# EasyEDA Pro project ProPrj_药盒0.11_2025-04-15.epro, board PCB1
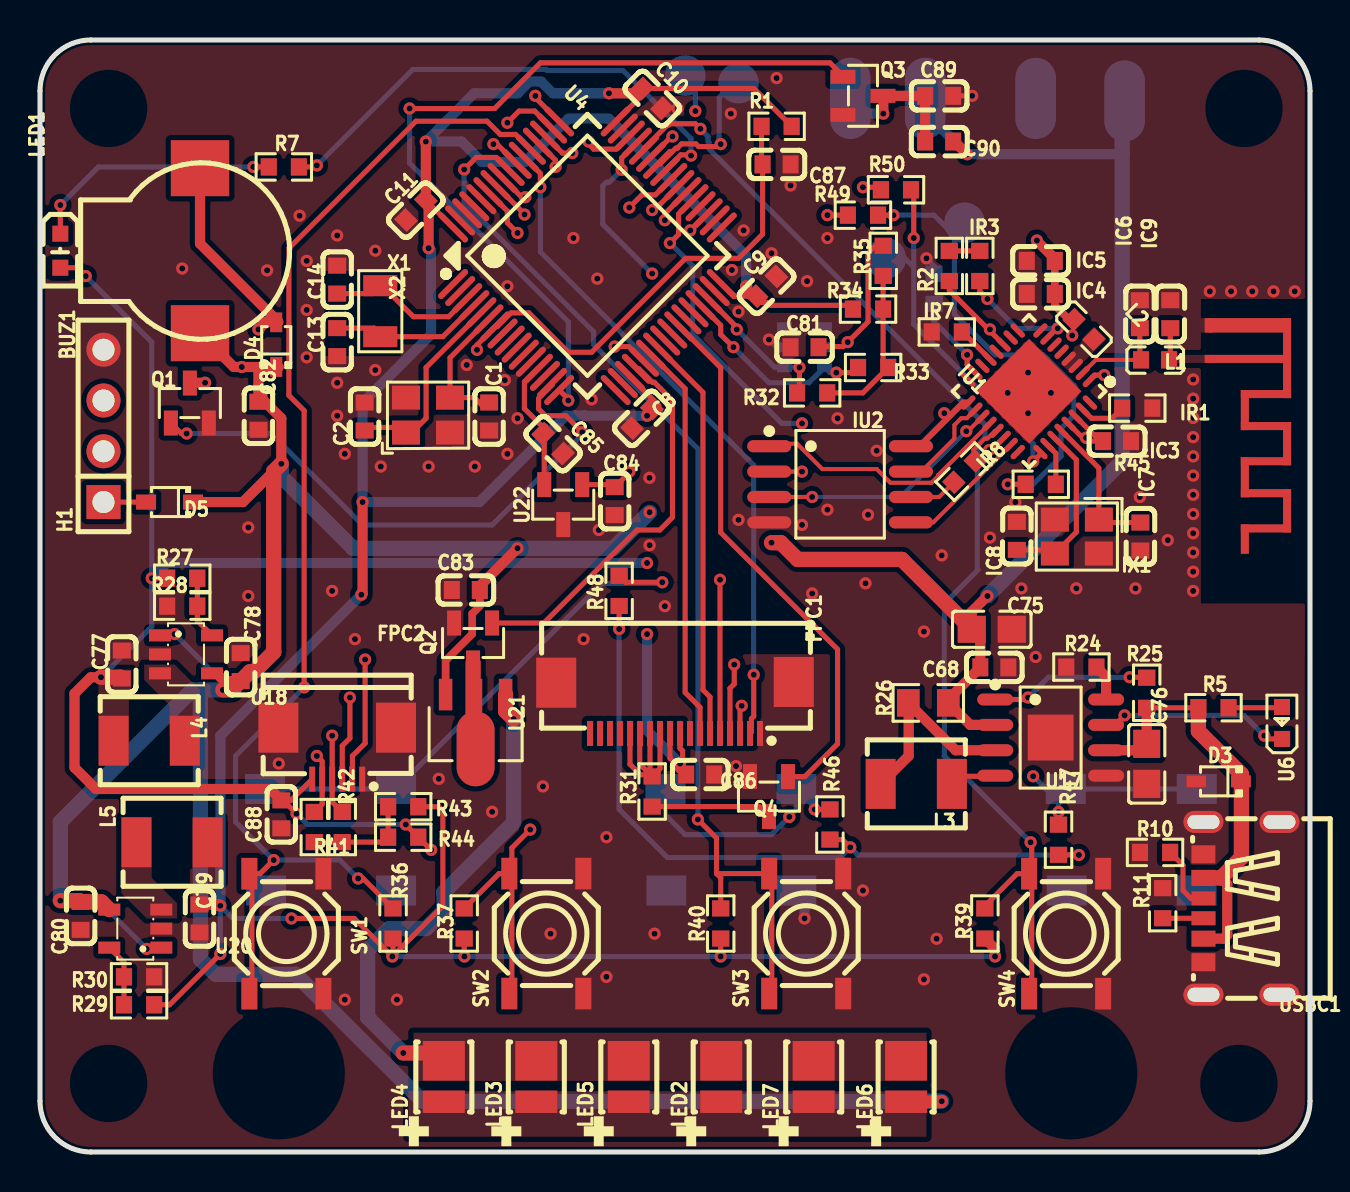
[diagram p9: board, top side]
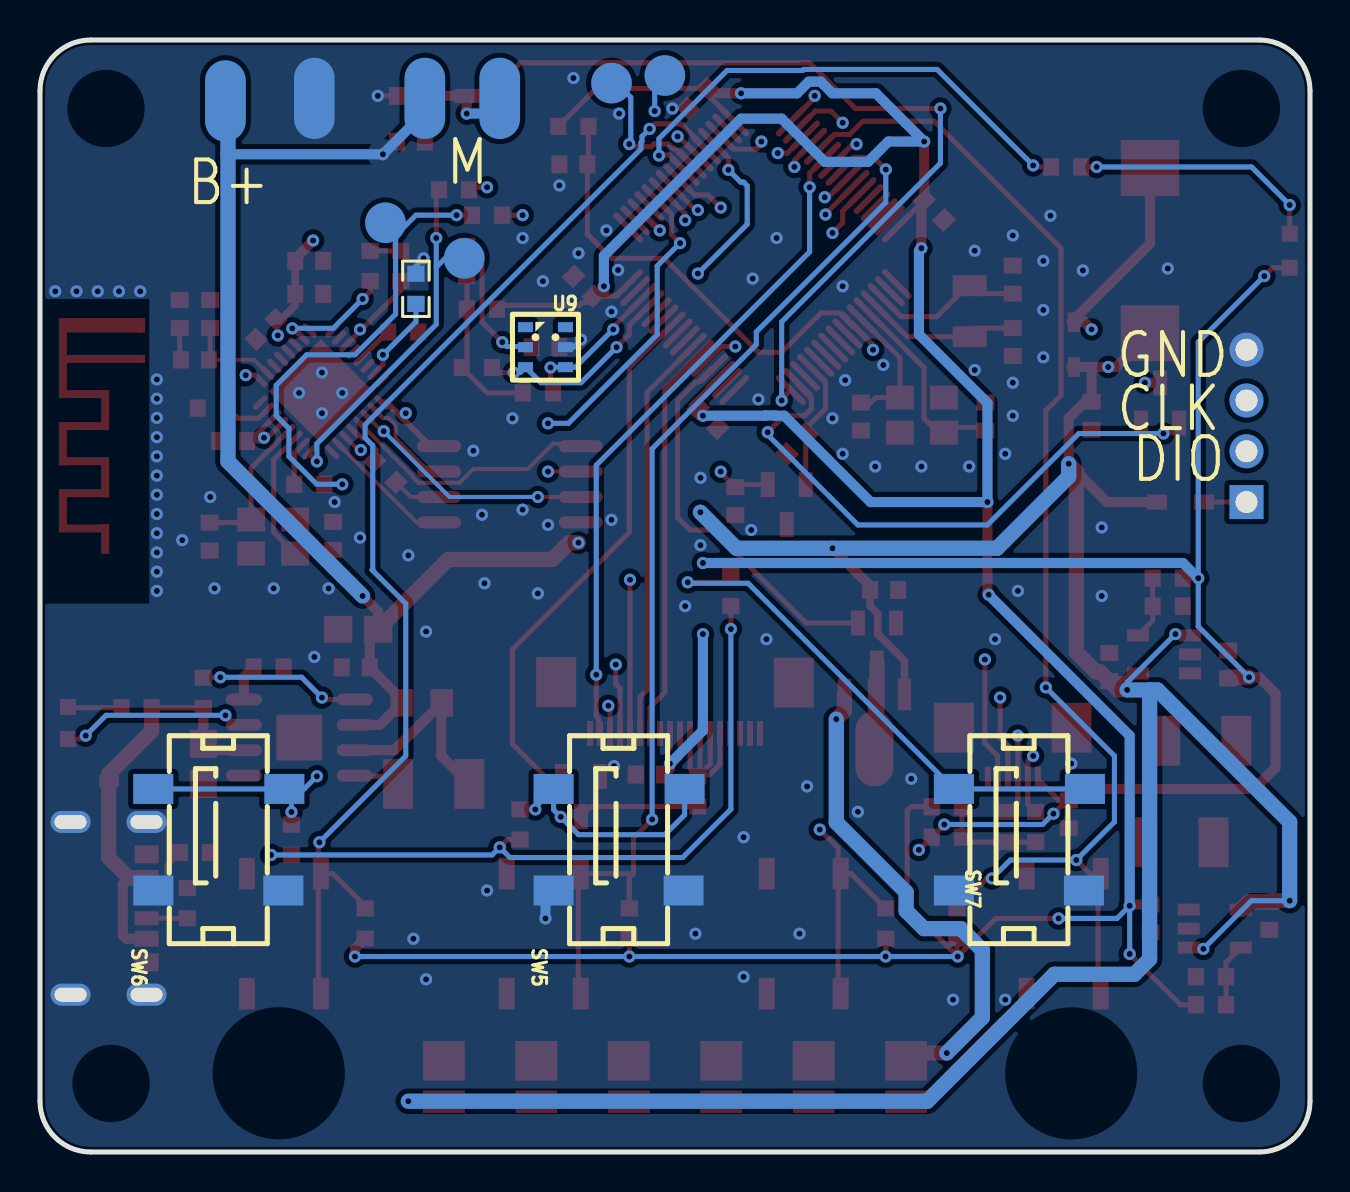
[diagram p10: board, bottom side, seen from below]

Outline 63.5 x 55.63 mm; copper layers: Top Layer, Inner1, Inner2, Bottom Layer. Coordinates in mm from the lower left corner of the outline.
Outline path: 0,53.09 0,2.54 arc(0.74,0.74) 2.54,0 60.96,0 arc(62.76,0.74) 63.5,2.54 63.5,53.09 arc(62.76,54.88) 60.96,55.63 2.54,55.63 arc(0.74,54.88) 0,53.09
Stack: Top Layer 0.035mm 外层铜厚1oz / Dielectric1 0.2104mm 7628 RC49% 8.6mil / Inner1 0.0152mm 内层铜厚 / Dielectric2 1.065mm 1.1mm H/HOZ Copper / Inner2 0.0152mm 内层铜厚 / Dielectric3 0.2104mm 7628 RC49% 8.6mil / Bottom Layer 0.035mm 外层铜厚1oz

## Design rules (mm)
template: 自定义配置
spacing copperThickness1oz (default): track to track 0.102, other pairs 0.152 to 0.3
spacing copperThickness2oz: track to track 0.203, other pairs 0.152 to 0.3
track width copperThickness1oz (default): min 0.127, default 0.254, max 2.54
track width copperThickness2oz: min 0.203, default 0.254, max 2.54
differential pair differentialPair (default): width min 0.127, default 0.254, max 2.54; gap min 0.152, default 0.152
via viaSize (default): diameter min 0.5, default 0.61, max 10; hole min 0.3, default 0.305, max 6.3

## Placement (name value [footprint] x y rotation side)
ANT2  -  [ANTENNA-2.4GHZ-MEANTRED]  62.36 40.51 90 top
BUZ1  9032蜂鸣器  [BUZ-SMD_KLJ-90XX-3627]  8 45.08 90 top
C1  22pF  [C0603]  22.46 36.79 90 top
C2  22pF  [C0603]  16.23 36.79 90 top
C8  100nF  [C0603]  30.1 36.7 45 top
C9  100nF  [C0603]  36.32 43.31 225 top
C10  100nF  [C0603]  30.61 52.7 135 top
C11  100nF  [C0603]  18.8 47.12 45 top
C13  22pF  [C0603]  14.86 40.51 90 top
C14  22pF  [C0603]  14.86 43.64 270 top
C68  100nF  [C0603]  47.72 24.24 0 top
C75  10uF  [C0805]  47.59 26.15 180 top
C76  22uF  [C0805]  55.34 19.42 270 top
C77  10uF  [C0603]  4.09 24.39 270 top
C78  10uF  [C0603]  10.03 24.26 270 top
C79  10uF  [C0603]  7.97 11.68 90 top
C80  10uF  [C0603]  2.03 11.81 90 top
C81  100nF  [C0603]  38.23 40.26 0 top
C82  1uF  [C0603]  10.92 36.83 90 top
C83  1uF  [C0603]  21.29 28.11 0 top
C84  1uF  [C0603]  28.74 32.56 90 top
C85  1uF  [C0603]  25.65 35.43 135 top
C86  1uF  [C0603]  33.01 18.88 180 top
C87  100nF  [C0603]  36.83 49.4 180 top
C88  1uF  [C0603]  12.06 16.89 90 top
C89  1uF  [C0603]  44.96 52.83 180 top
C90  100nF  [C0603]  44.96 50.55 180 top
D3  PESD5V0S1BA  [SOD-323_L1.7-W1.3-LS2.5-FD-1]  58.93 18.54 0 top
D4  5819WS  [SOD-323_L1.7-W1.3-LS2.5-FD-1]  11.81 40.39 270 top
D5  1N5819WS  [SOD-323_L1.8-W1.3-LS2.5-RD]  6.48 32.51 180 top
FPC1  FPC-05F-18PH20  [FPC-SMD_18P-P0.50_FPC-05F-18PH20]  31.75 22.22 180 top
FPC2  FPC-05F-6PH20  [FPC-SMD_6P-P0.50_XUNPU_FPC-05F-6PH20]  14.86 19.94 180 top
H1  Header-Male-2.54_1x4  [HDR-TH_4P-P2.54-V-M]  3.17 36.32 90 top
IC3  1uf  [C0603]  53.85 35.56 180 top
IC4  100nf  [C0603]  50.04 42.93 0 top
IC5  10uf  [C0603]  50.04 44.58 0 top
IC6  3.0pf  [C0603]  54.99 41.91 270 top
IC7  6.8pf  [C0603]  55.02 30.79 270 top
IC8  6.8pf  [C0603]  48.84 30.82 90 top
IC9  2.4pf  [C0603]  56.51 41.91 270 top
IR1  12k  [R0603]  54.86 37.21 180 top
IR3  10k  [R0603]  46.99 44.32 270 top
IR7  10k  [R0603]  45.34 41.02 0 top
IR8  200R  [R0603]  46.23 34.04 45 top
IU1  ESP8266EX  [QFN-32_L5.0-W5.0-P0.50-BL-EP3.7]  49.45 38.05 135 top
IU2  BH25Q64BSSIG  [SOP-8_L5.3-W5.3-P1.27-LS8.0-BL]  40 33.4 270 top
IX1  26MHz  [CRYSTAL-SMD_4P-L3.2-W2.5-BL]  51.84 30.79 180 top
L1  2.2nh  [L0603]  55.75 39.62 180 top
L2  4.3nh  [L0603]  52.2 41.15 315 top
L3  4.7uH  [IND-SMD_L4.9-W4.4_MAPM0420F]  43.81 18.41 0 top
L4  2.2uH  [IND-SMD_L4.9-W4.4_MAPM0420F]  5.46 20.57 180 top
L5  2.2uH  [IND-SMD_L4.9-W4.4_MAPM0420F]  6.6 15.49 0 top
LED1  19-217/GHC-YR1S2/3T  [LED0603-R-RD]  1.02 45.08 270 top
LED2  2835  [LED-SMD_L3.5-W2.8_2835]  34.06 3.54 90 top
LED3  2835  [LED-SMD_L3.5-W2.8_2835]  24.82 3.54 90 top
LED4  2835  [LED-SMD_L3.5-W2.8_2835]  20.19 3.54 90 top
LED5  2835  [LED-SMD_L3.5-W2.8_2835]  29.44 3.54 90 top
LED6  2835  [LED-SMD_L3.5-W2.8_2835]  43.31 3.54 90 top
LED7  2835  [LED-SMD_L3.5-W2.8_2835]  38.68 3.54 90 top
NOREF  -  [Pad_e279]  49.78 52.7 0 top
NOREF#2  -  [Pad_e3203]  42.29 44.7 90 top
NOREF#3  -  [Pad_e1042]  44.26 52.7 0 top
NOREF#4  -  [Pad_e612]  34.93 53.47 90 top
NOREF#5  -  [Pad_e1043]  40.51 52.7 0 top
NOREF#6  -  [Pad_e3204]  46.23 46.48 90 top
NOREF#7  -  [Pad_e68]  54.23 52.58 0 top
NOREF#8  -  [Pad_e611]  32.26 53.85 90 top
Q1  SI2300  [SOT-23-3_L2.9-W1.3-P1.90-LS2.4-BR]  7.49 37.46 270 top
Q2  SI2300  [SOT-23-3_L2.9-W1.3-P1.90-LS2.4-BR]  21.65 25.46 90 top
Q3  SI2300  [SOT-23-3_L2.9-W1.3-P1.90-LS2.4-BR]  41.15 52.83 180 top
Q4  SI2300  [SOT-23-3_L2.9-W1.3-P1.90-LS2.4-BR]  36.45 17.78 90 top
R1  10k  [R0603]  36.83 51.31 0 top
R2  R0  [R0603]  45.47 44.32 90 top
R5  1kΩ  [R0603]  58.67 22.22 0 top
R7  10KΩ  [R0603]  12.19 49.28 180 top
R10  5.1kΩ  [R0603]  55.75 14.99 0 top
R11  5.1kΩ  [R0603]  56.13 12.45 270 top
R24  20kΩ  [R0603]  52.07 24.26 0 top
R25  10kΩ  [R0603]  55.34 22.97 270 top
R26  0.5Ω  [R0805]  44.41 22.46 0 top
R27  442kΩ  [R0603]  7.11 28.7 180 top
R28  100kΩ  [R0603]  7.11 27.3 0 top
R29  200kΩ  [R0603]  4.95 7.37 0 top
R30  100kΩ  [R0603]  4.95 8.76 180 top
R31  10Ω  [R0603]  30.61 18.03 270 top
R32  4.7kΩ  [R0603]  38.61 37.97 0 top
R33  4.7kΩ  [R0603]  41.66 39.24 0 top
R34  0  [R0603]  41.4 42.16 180 top
R35  0  [R0603]  42.16 44.58 90 top
R36  10kΩ  [R0603]  17.65 11.43 270 top
R37  10kΩ  [R0603]  21.21 11.43 270 top
R39  10kΩ  [R0603]  47.24 11.43 270 top
R40  10kΩ  [R0603]  34.04 11.43 270 top
R41  2k  [R0603]  13.72 16.26 270 top
R42  2k  [R0603]  15.11 16.26 270 top
R43  0  [R0603]  18.16 17.27 0 top
R44  0  [R0603]  18.16 15.75 0 top
R45  499  [R0603]  50.04 33.4 180 top
R46  10kΩ  [R0603]  39.5 16.38 270 top
R47  10kΩ  [R0603]  50.93 15.62 270 top
R48  10kΩ  [R0603]  28.96 28.07 270 top
R49  0  [R0603]  41.15 46.86 0 top
R50  0  [R0603]  42.8 48.13 0 top
R51  0  [R0603]  44.7 43.18 270 bottom
SW1  TS-1076S-A6B2  [SW-SMD_4P-L5.2-W5.2-P3.70-LS6.4]  12.32 10.92 90 top
SW2  TS-1076S-A6B2  [SW-SMD_4P-L5.2-W5.2-P3.70-LS6.4]  25.32 10.93 90 top
SW3  TS-1076S-A6B2  [SW-SMD_4P-L5.2-W5.2-P3.70-LS6.4]  38.31 10.93 90 top
SW4  TS-1076S-A6B2  [SW-SMD_4P-L5.2-W5.2-P3.70-LS6.4]  51.31 10.92 90 top
SW5  TM-1618D  [SW-SMD_TM-1618D]  34.54 15.62 90 bottom
SW6  TM-1618D  [SW-SMD_TM-1618D]  54.56 15.62 90 bottom
SW7  TM-1618D  [SW-SMD_TM-1618D]  14.53 15.62 90 bottom
U4  STM32L431RCT6  [LQFP-64_L10.0-W10.0-P0.50-LS12.0-BL]  27.37 44.83 315 top
U6  RED  [LED0603-RD]  62.1 21.46 90 top
U9  AHT30  [MIC-SMD_6P-L3.0-W3.0-P1.00-TL]  38.23 40.26 180 bottom
U17  ME4059ASPG  [SOP-8_L4.9-W3.9-P1.27-LS6.0-BL-EP]  50.53 20.73 270 top
U18  TLV62569DBVR  [SOT-23-5_L3.0-W1.7-P0.95-LS2.8-BR]  7.3 24.89 180 top
U20  TLV62569DBVR  [SOT-23-5_L3.0-W1.7-P0.95-LS2.8-BR]  4.76 11.17 0 top
U21  MEL7135PG-N  [SOT-89-3_L4.5-W2.5-P1.50-LS4.2-BR]  21.78 21.53 90 top
U22  REF3025  [SOT-23-3_L2.9-W1.3-P0.95-LS2.4-BR]  26.16 32.38 90 top
USBC1  USB 3.1 C 6PF  [USB-C-SMD_TYPE-C-USB-13]  60.07 12.19 90 top
X1  8MHz  [OSC-SMD_4P-L3.2-W2.5-BL]  19.4 36.86 0 top
X2  -  [OSC-SMD_L3.2-W1.5]  17.01 42.06 270 top

## Footprints (pads in the part's own frame, mm; a bottom-side part is the same pattern mirrored in y, then rotated)
ANTENNA-2.4GHZ-MEANTRED
  rect 0.4x0.4 smd: 1(-0.84,3.922)
  rect 0.72x0.4 smd: 2(0.84,3.922)
BUZ-SMD_KLJ-90XX-3627
  rect 2.8x2.92 smd: 1(-4.128,0) 2(4.128,0)
C0603
  rect 0.8x0.9 smd: 1(-0.7,0) 2(0.7,0)
C0805
  rect 1.41x1.35 smd: 1(-1,0) 2(1,0)
CRYSTAL-SMD_4P-L3.2-W2.5-BL
  rect 1.4x1.2 smd: 1(-1.1,-0.85) 2(1.1,-0.85) 3(1.1,0.85) 4(-1.1,0.85)
FPC-SMD_6P-P0.50_XUNPU_FPC-05F-6PH20
  rect 0.3x1.25 smd: 1(-1.25,1.288) 2(-0.75,1.288) 3(-0.25,1.288) 4(0.25,1.288) 5(0.75,1.288) 6(1.25,1.288)
  rect 2x2.5 smd: 7(2.94,-1.288) 8(-2.94,-1.288)
FPC-SMD_18P-P0.50_FPC-05F-18PH20
  rect 0.3x1.25 smd: 1(-4.25,1.288) 2(-3.75,1.288) 3(-3.25,1.288) 4(-2.75,1.288) 5(-2.25,1.288) 6(-1.75,1.288) 7(-1.25,1.288) 8(-0.75,1.288) 9(-0.25,1.288) 10(0.25,1.288) 11(0.75,1.288) 12(1.25,1.288) 13(1.75,1.288) 14(2.25,1.288) 15(2.75,1.288) 16(3.25,1.288) 17(3.75,1.288) 18(4.25,1.288)
  rect 2x2.5 smd: 19(-5.94,-1.288) 20(5.94,-1.252)
HDR-TH_4P-P2.54-V-M
  rect 1.7x1.7 hole 1.1: 1(-3.81,0)
  round 1.7 hole 1.1: 2(-1.27,0) 3(1.27,0) 4(3.81,0)
IND-SMD_L4.9-W4.4_MAPM0420F
  rect 1.5x2.5 smd: 1(-1.78,0) 2(1.78,0)
L0603
  rect 0.8x0.864 smd: 1(-0.7,0) 2(0.7,0)
LED0603-R-RD
  rect 0.8x0.8 smd: 1(0.851,0) 2(-0.851,0)
LED0603-RD
  rect 0.8x0.8 smd: 1(-0.799,-0.004) 2(0.799,0.004)
LED-SMD_L3.5-W2.8_2835
  rect 1.12x2.1 smd: 1(-1.025,0)
  rect 1.98x2.1 smd: 2(1.025,0)
LQFP-64_L10.0-W10.0-P0.50-LS12.0-BL
  oval 0.3x2 smd: 1(-3.75,-5.75) 2(-3.25,-5.749) 3(-2.75,-5.75) 4(-2.25,-5.75) 5(-1.75,-5.75) 6(-1.25,-5.75) 7(-0.75,-5.75) 8(-0.25,-5.75) 9(0.25,-5.75) 10(0.75,-5.75) 11(1.25,-5.75) 12(1.75,-5.75) 13(2.25,-5.75) 14(2.75,-5.75) 15(3.25,-5.749) 16(3.75,-5.75) 33(3.75,5.75) 34(3.25,5.749) 35(2.75,5.75) 36(2.25,5.75) 37(1.75,5.75) 38(1.25,5.75) 39(0.75,5.75) 40(0.25,5.75) 41(-0.25,5.75) 42(-0.75,5.75) 43(-1.25,5.75) 44(-1.75,5.75) 45(-2.25,5.75) 46(-2.75,5.75) 47(-3.25,5.749) 48(-3.75,5.75)
  oval 2x0.3 smd: 17(5.75,-3.75) 18(5.749,-3.25) 19(5.75,-2.75) 20(5.75,-2.25) 21(5.75,-1.75) 22(5.75,-1.25) 23(5.75,-0.75) 24(5.75,-0.25) 25(5.75,0.25) 26(5.75,0.75) 27(5.75,1.25) 28(5.75,1.75) 29(5.75,2.25) 30(5.75,2.75) 31(5.749,3.25) 32(5.75,3.75) 49(-5.75,3.75) 50(-5.749,3.25) 51(-5.75,2.75) 52(-5.75,2.25) 53(-5.75,1.75) 54(-5.75,1.25) 55(-5.75,0.75) 56(-5.75,0.25) 57(-5.75,-0.25) 58(-5.75,-0.75) 59(-5.75,-1.25) 60(-5.75,-1.75) 61(-5.75,-2.25) 62(-5.75,-2.75) 63(-5.749,-3.25) 64(-5.75,-3.75)
MIC-SMD_6P-L3.0-W3.0-P1.00-TL
  rect 0.75x0.5 smd: 1(-1,1) 2(-1,0) 3(-1,-1) 4(1,-1) 5(1,0) 6(1,1)
OSC-SMD_4P-L3.2-W2.5-BL
  rect 1.4x1.2 smd: 1(-1.1,-0.875) 2(1.1,-0.875) 3(1.1,0.875) 4(-1.1,0.875)
OSC-SMD_L3.2-W1.5
  rect 1.05x1.7 smd: 1(-1.275,0) 2(1.275,0)
Pad_e68
  oval 2.032x4.064 smd far side: 1(0,0)
Pad_e279
  oval 2.032x4.064 smd far side: 1(0,0)
Pad_e611
  round 2.032 smd far side: 1(0,0)
Pad_e612
  round 2.032 smd far side: 2(0,0)
Pad_e1042
  oval 2.032x4.064 smd far side: 1(0,0)
Pad_e1043
  oval 2.032x4.064 smd far side: 1(0,0)
Pad_e3203
  round 2.032 smd far side: 2(0,0)
Pad_e3204
  round 2.032 smd far side: 2(0,0)
QFN-32_L5.0-W5.0-P0.50-BL-EP3.7
  oval 0.28x0.9 smd: 1(-1.75,-2.55) 2(-1.25,-2.55) 3(-0.75,-2.55) 4(-0.25,-2.55) 5(0.25,-2.55) 6(0.75,-2.55) 7(1.25,-2.55) 8(1.75,-2.55) 17(1.75,2.55) 18(1.25,2.55) 19(0.75,2.55) 20(0.25,2.55) 21(-0.25,2.55) 22(-0.75,2.55) 23(-1.25,2.55) 24(-1.75,2.55)
  oval 0.9x0.28 smd: 9(2.55,-1.75) 10(2.55,-1.25) 11(2.55,-0.75) 12(2.55,-0.25) 13(2.55,0.25) 14(2.55,0.75) 15(2.55,1.25) 16(2.55,1.75) 25(-2.55,1.75) 26(-2.55,1.25) 27(-2.55,0.75) 28(-2.55,0.25) 29(-2.55,-0.25) 30(-2.55,-0.75) 31(-2.55,-1.25) 32(-2.55,-1.75)
  rect 3.7x3.7 smd: 33(0,0)
R0603
  rect 0.806x0.864 smd: 1(-0.753,0) 2(0.753,0)
R0805
  rect 1.133x1.377 smd: 1(-1,0) 2(1,0)
SOD-323_L1.7-W1.3-LS2.5-FD-1
  rect 0.985x0.6 smd: 1(-1.117,0) 2(1.117,0)
SOD-323_L1.8-W1.3-LS2.5-RD
  rect 1x0.75 smd: 1(-1.173,0) 2(1.173,0)
SOP-8_L4.9-W3.9-P1.27-LS6.0-BL-EP
  oval 0.6x1.8 smd: 1(-1.905,-2.772) 2(-0.635,-2.772) 3(0.635,-2.772) 4(1.905,-2.772) 5(1.905,2.772) 6(0.635,2.772) 7(-0.635,2.772) 8(-1.905,2.772)
  rect 2.29x2.29 smd: 9(0,0)
SOP-8_L5.3-W5.3-P1.27-LS8.0-BL
  oval 0.609x2.204 smd: 1(-1.905,-3.542) 2(-0.635,-3.542) 3(0.635,-3.542) 4(1.905,-3.542) 5(1.905,3.542) 6(0.635,3.542) 7(-0.635,3.542) 8(-1.905,3.542)
SOT-23-3_L2.9-W1.3-P0.95-LS2.4-BR
  rect 1.25x0.7 smd: 1(1,-0.95) 2(1,0.95) 3(-1,0)
SOT-23-3_L2.9-W1.3-P1.90-LS2.4-BR
  rect 1.25x0.7 smd: 1(1,-0.95) 2(1,0.95) 3(-1,0)
SOT-23-5_L3.0-W1.7-P0.95-LS2.8-BR
  rect 1.1x0.6 smd: 1(1.3,-0.95) 2(1.3,0) 3(1.3,0.95) 4(-1.3,0.95) 5(-1.3,-0.95)
SOT-89-3_L4.5-W2.5-P1.50-LS4.2-BR
  rect 1.575x0.672 smd: 1(1.356,-1.5) 3(1.356,1.5)
  custom 5.377x1.9 smd: 2(-1.356,0)
SW-SMD_4P-L5.2-W5.2-P3.70-LS6.4
  rect 1.58x0.8 smd: 1(-3,1.85) 2(3,1.85) 3(-3,-1.85) 4(3,-1.85)
SW-SMD_TM-1618D
  rect 1.5x2 smd: 1(-2.54,3.276) 2(-2.54,-3.224) 3(2.54,3.276) 4(2.54,-3.276)
USB-C-SMD_TYPE-C-USB-13
  oval 1.1x2 hole 0.7x1.6: 1(-4.32,1.899) 2(-4.32,-1.901) 3(4.32,-1.901) 4(4.32,1.899)
  rect 0.7x1.2 smd: A5(-0.5,1.897) B5(0.5,1.897)
  rect 0.8x1.2 smd: A9(-1.52,1.899) B9(1.52,1.901)
  rect 0.9x1.2 smd: A12(-2.7,1.899) B12(2.7,1.899)

## Nets
As in the schematic, except:
GND: ANT2.2 C1.1 C2.2 C8.1 C9.1 C10.1 C11.1 C13.1 C14.1 C68.2 C75.1 C76.2 C77.1 C78.1 C79.1 C80.1 C81.1 C82.1 C83.1 C84.1 C85.1 C86.1 C87.1 C88.1 C89.1 D3.1 FPC1.1 FPC1.8 FPC1.19 FPC1.20 FPC2.1 FPC2.7 FPC2.8 H1.4 IC3.1 IC4.1 IC5.1 IC6.1 IC7.2 IC8.2 IC9.1 IR1.1 IR7.1 IU1.33 IU2.4 IX1.2 IX1.4 NOREF.1 Q1.2 Q2.2 Q3.2 Q4.2 R10.1 R11.1 R24.1 R28.1 R30.1 R51.1 SW1.3 SW1.4 SW2.3 SW2.4 SW3.3 SW3.4 SW4.3 SW4.4 SW5.1 SW5.2 SW6.1 SW6.2 SW7.1 SW7.2 U4.12 U4.18 U4.31 U4.47 U4.60 U4.63 U9.5 U17.5 U17.9 U18.2 U20.2 U22.3 USBC1.1 USBC1.2 USBC1.3 USBC1.4 USBC1.A12 USBC1.B12 X1.2 X1.4
ANT: ANT2.1 IC9.2 L1.1
BAT+: BUZ1.1 C68.1 C75.2 C78.2 C80.2 C82.2 C83.2 C84.2 C90.1 D4.2 D5.1 LED2.1 LED3.1 LED4.1 LED5.1 LED6.1 LED7.1 NOREF#3.1 NOREF#7.1 R26.2 U17.2 U18.1 U18.4 U20.1 U20.4 U21.3 U22.1
PA9: NOREF#4.2 U4.42
PA10: NOREF#8.1 U4.43
$1N34275: C89.2 C90.2 NOREF#5.1 Q3.3
$1N37143: NOREF#6.2 R45.2 R49.2
$1N37193: IU1.25 NOREF#2.2 R50.2

Pads without a net: FPC1 15 16 17 18; IU1 5 6; U4 1; U9 1 6

## Via types
v1: diameter 0.61, hole 0.305, Top Layer to Bottom Layer, 223 vias

## Routing (per net, layer and track width the routed paths; a pad name or vN(x,y) marks a point on that pad's centre or on a via; arc(x,y) is an arc through that point)
3V3: length 176.2
  Top Layer w0.254: C81.2 38.96,40.29 40.16,40.29 v1(40.39,40.51) 41.4,41.53 41.4,44.96 41.77,45.33 R35.2 ; R27.2 v1(5.59,28.7) ; IU1.1 52.74,38.86 v1(53.21,38.86) ; 53.01,35.56 52.3,35.56 IU1.29 ; 53.01,35.56 IU1.30 ; 53.01,35.56 IC3.2 ; LED1.1 1.87,44.23 v1(2.29,43.81) ; 32,19.19 31.5,19.69 FPC1.10 ; 32.13,19.43 32.13,20.07 32,20.2 FPC1.9 ; C88.2 12.55,17.59 FPC2.6 ; v1(18.29,16.38) 18.29,16.37 R44.2 19.55,15.11 v1(19.56,15.11) ; IU1.11 45.47,43.1 R2.1 ; v1(12.83,16.92) 12.16,17.59
  Top Layer w0.305: IU1.17 46.16,37.49 44.1,35.43 43.67,35.43 IU2.8
  Top Layer w0.381: IC5.2 IC4.2 50.74,42.35 51.45,41.64 L2.1
  Top Layer w0.508: v1(3.05,23.75) 2.54,23.75 1.73,22.93 1.73,19.23 2.79,18.16 11.5,18.16 C88.2 ; IC5.2 50.74,44.68 49.85,45.58 v1(49.85,45.6) ; v1(32,19.43) 32,19.19 C86.2
  Top Layer w0.762: v1(3.05,23.75) 4.03,23.75 C77.2
  Inner1 w0.508: v1(30.35,29.46) v1(30.35,25.91)
  Inner1 w0.762: v1(45.21,36.96) 41.91,36.96 40.39,35.43 40.39,29.97 39.88,29.46 v1(30.35,29.46)
  Inner2 w0.254: v1(40.39,40.51) 41.66,40.51 v1(45.21,36.96)
  Inner2 w0.508: 51.61,40.62 51.38,40.39 48.26,40.39 v1(47.5,41.15) ; 51.61,40.62 53.21,39.01 v1(53.21,38.86) ; 51.61,40.62 51.61,36.42 52.22,35.81 49.4,35.81 48.26,36.96 v1(45.21,36.96) 45.21,41.52 49.29,45.6 v1(49.85,45.6)
  Bottom Layer w0.254: v1(2.29,43.81) 5.59,40.51 v1(5.59,28.7) 5.59,26.29 v1(3.05,23.75) ; v1(12.83,16.92) 13.37,16.38 v1(18.29,16.38) ; U9.2 39.26,40.29 40.16,40.29
  Bottom Layer w0.508: v1(30.35,25.91) 30.35,21.08 v1(32,19.43) ; v1(30.35,29.46) 6.35,29.46 v1(5.59,28.7)
  vias: v1(51.61,40.85) v1(52.3,35.73)
GND: length 4.4
  Top Layer w0.254: C89.1 v1(46.61,52.83)
  Bottom Layer w0.254: R51.1 44.7,44.32 v1(44.32,44.7) ; U9.5 36.83,40.26 v1(36.45,40.64)
  Bottom Layer w0.508: SW5.1 38.23,12.67 v1(38.23,11.68)
  vias: v1(7.11,44.2) v1(10.41,31.24) v1(10.41,27.81) v1(11.35,44.1) v1(11.94,19.43) v1(12.98,46.84) v1(13.34,44.58) v1(13.34,42.12) v1(13.34,39.75) v1(14.6,28.07) v1(14.86,45.85) v1(14.86,38.48) v1(14.86,36.83) v1(15.24,34.92) v1(15.24,7.62) v1(15.75,25.65) v1(16.76,45.08) v1(16.76,39.12) v1(17.04,34.29) v1(17.85,7.62) v1(19.43,34.29) v1(19.94,18.67) v1(21.34,39.37) v1(21.74,34.29) v1(22.61,17.02) v1(23.24,38.61) v1(23.37,43.31) v1(23.37,34.92) v1(23.88,36.7) v1(25.15,18.29) v1(25.53,10.92) v1(26.67,45.72) v1(27.18,25.65) v1(27.58,37.65) v1(27.86,43.69) v1(27.94,31.11) v1(28.32,15.75) v1(28.32,8.76) v1(30.47,33.72) v1(30.48,30.35) v1(30.73,10.92) v1(31.24,27.3) v1(31.88,52.2) v1(34.54,51.94) v1(34.59,44.12) v1(34.8,19.3) v1(34.93,42.04) v1(34.93,31.62) v1(35.18,46.1) v1(36.58,44.96) v1(36.83,53.72) v1(37.53,48.35) v1(38.1,31.37) v1(38.35,43.56) v1(38.61,27.94) v1(39.37,45.72) v1(39.37,32.13) v1(39.88,36.7) v1(41.15,13.08) v1(41.28,28.45) v1(41.4,31.88) v1(41.83,35.08) v1(44.2,26.03) v1(44.2,8.64) v1(44.83,10.67) v1(45.09,29.84) v1(47.5,30.73) v1(48.39,37.97) v1(48.77,32.51) v1(49.07,28.19) v1(49.4,38.99) v1(49.4,36.96) v1(49.78,24.77) v1(50.55,37.97) v1(51.82,28.19) v1(54.77,28.19) v1(54.99,32.77) v1(56.39,30.61) v1(57.66,38.64) v1(57.66,37.68) v1(57.66,36.72) v1(57.66,35.76) v1(57.66,34.8) v1(57.66,33.84) v1(57.66,32.88) v1(57.66,31.91) v1(57.66,30.95) v1(57.66,29.99) v1(57.66,29.03) v1(57.66,28.07) v1(58.49,43.05) v1(59.55,43.05) v1(60.61,43.05) v1(61.68,43.05) v1(62.74,43.05)
1.8: length 174.8
  Top Layer w0.254: v1(21.22,9.78) 21.21,9.79 R37.2 ; R34.2 40.46,42.35 36.52,42.35 36.38,42.49 36.02,42.49 35.83,42.68 35.83,42.81 34.7,42.81 34.09,43.42 ; 29.96,53.05 29.96,52.72 U4.48 ; 17.65,9.82 20.14,12.3 20.14,17.07 19.94,17.27 R43.2 ; 17.65,9.82 v1(17.62,9.78) 15.71,11.68 v1(12.57,11.68) ; 17.65,9.82 R36.2 ; v1(34.03,9.78) 34.04,9.78 R40.2 ; 30.11,53.2 35.69,53.2 R1.2 ; R29.2 6.48,7.37 v1(9.02,9.91) ; 20.65,46.25 19.43,47.47 ; U4.19 29.49,38.79 30.95,37.34
  Top Layer w0.508: v1(16.13,32.51) 16.13,27.94 v1(16.07,27.88) ; 19.29,47.61 v1(19.29,50.55) ; R39.2 47.75,10.17 v1(47.75,9.78) ; C79.2 8.95,12.38 v1(9.02,12.32) ; v1(28.45,52.96) 29.87,52.96 ; v1(35.31,43.31) 35.31,43.05 35.32,43.04 ; 19.43,47.47 v1(19.43,45.21)
  Bottom Layer w0.254: v1(17.62,9.78) v1(21.22,9.78) v1(34.03,9.78) v1(47.75,9.78) ; v1(9.02,9.91) v1(9.02,12.32) 9.65,11.68 v1(12.57,11.68)
  Bottom Layer w0.508: v1(28.45,52.96) 25.64,52.96 25.06,53.54 24.47,53.54 23.89,52.96 21.7,52.96 v1(19.29,50.55) 21.08,50.55 22.1,49.53 24.26,49.53 26.42,51.69 28.45,51.69 35.31,44.83 v1(35.31,43.31) ; v1(19.43,45.21) 19.55,45.09 19.55,40.9 16.13,37.48 v1(16.13,32.51) 21.97,32.51 26.29,36.83 26.73,36.83 26.75,36.84 27.23,36.84 27.24,36.83 v1(30.35,36.83) ; v1(16.07,27.88) 9.02,20.83 v1(9.02,12.32)
A1: length 82.3
  Top Layer w0.254: R46.2 40.12,15.63 v1(40.51,15.24) ; R48.2 v1(28.96,26.16) ; R47.2 51.93,14.87 v1(51.94,14.86) ; 32.67,47.66 31.93,46.92 31.93,45.9 v1(31.5,45.47)
  Inner2 w0.254: v1(51.94,14.86) 51.94,22.35 50.55,23.75 48.13,23.75 41.4,30.48 39.88,30.48 36.96,33.4 36.96,35.31 v1(38.1,36.45)
  Bottom Layer w0.254: v1(51.94,14.86) 40.89,14.86 v1(40.51,15.24) 40,14.73 31.37,14.73 28.96,17.14 v1(28.96,26.16) ; v1(38.1,36.45) 37.08,36.45 32.64,40.89 32.64,44.32 v1(31.5,45.47)
A2: length 50.4
  Top Layer w0.254: R46.1 v1(38.74,17.14) ; U4.45 29.08,49.73 v1(29.08,49.13)
  Inner2 w0.254: v1(37.47,16.76) 37.47,23.75 32.89,28.32 32.89,41.66 v1(30.61,43.94)
  Bottom Layer w0.254: v1(38.74,17.14) 38.74,17.25 SW5.3 37.82,17.12 v1(37.47,16.76) 36.58,15.88 32.26,15.88 31.27,16.86 SW5.4 ; v1(30.61,43.94) 28.14,46.41 28.14,48.33 28.32,48.51 28.47,48.51 v1(29.08,49.13)
A3: length 47.7
  Top Layer w0.254: R47.1 v1(50.93,17.01) ; v1(31.24,46.61) 31.24,46.94 32.32,48.02
  Inner2 w0.254: v1(31.24,46.61) 31.24,46.54 35.81,41.97 35.81,32.64 v1(49.66,18.8)
  Bottom Layer w0.254: SW6.4 SW6.3 ; SW6.4 50.93,17.8 v1(50.93,17.01) ; SW6.4 50.29,18.16 v1(49.66,18.8)
A4: length 52.9
  Top Layer w0.254: U4.35 32.53,46.1 v1(32.51,46.1) ; v1(31.12,28.5) 29.28,28.5 R48.1
  Inner2 w0.254: v1(31.12,28.5) 31.12,33.91 29.46,35.56 29.46,40.39 28.45,41.4 28.45,47.37 29.08,48.01 30.8,48.01 32.26,46.55 32.26,46.35 v1(32.51,46.1)
  Bottom Layer w0.254: SW7.4 SW7.3 28.09,28.45 31.06,28.45 v1(31.12,28.5)
ANT: length 1.6
  Top Layer w0.254: 56.45,39.62 56.51,39.69 IC9.2
BAT+: length 216.3
  Top Layer w0.254: U18.1 6.06,25.91 v1(6.73,25.91) ; U22.1 28.61,33.38 C84.2 29.46,33.99 v1(29.46,34.04) ; U20.1 6,10.16 v1(5.33,10.16)
  Top Layer w0.381: 20.28,22.88 20.28,24.58 21.61,25.91 21.61,26.93 21.99,27.31 21.99,27.83
  Top Layer w0.508: C78.2 9.21,23.56 9.02,23.75 ; v1(47.37,27.81) 46.59,27.03 C75.2 47.02,25.72 C68.1 45.41,22.64 R26.2 46.51,21.37 U17.2 ; 11.68,34.05 10.15,32.51 D5.1 ; v1(12.06,34.43) 12.06,36.7 11.24,37.53 C82.2 10.92,39.25 10.94,39.27 ; 10.94,39.27 v1(10.09,39.27) 9.69,39.27 BUZ1.1 ; 10.94,39.27 11.94,39.27 ; C90.1 45.72,50.55 v1(46.35,49.91) ; 21.99,27.83 C83.2 21.99,28.32 v1(23.88,30.2)
  Top Layer w0.635: LED6.1 45.06,2.51 v1(45.09,2.54)
  Top Layer w0.762: C75.2 43.09,29.64 37.88,29.64 37.04,30.48 v1(36.58,30.48) ; v1(12.06,34.43) 11.68,34.05 11.68,25 10.7,24.02 10.5,24.02 C78.2 9.59,23.11 v1(9.14,23.11) ; v1(1.02,12.57) 1.97,12.57 C80.2 3.08,12.51 U20.4
  Inner1 w0.762: v1(29.46,34.04) 29.46,33.15 32.13,30.48 v1(36.58,30.48)
  Bottom Layer w0.254: v1(6.73,25.91) 9.14,23.49 v1(9.14,23.11) ; v1(5.33,10.16) 2.92,12.57 v1(1.02,12.57)
  Bottom Layer w0.508: 54.1,49.93 54.09,49.91 v1(46.35,49.91) 44.26,52.01 NOREF#3.1
  Bottom Layer w0.762: v1(12.06,34.43) 12.06,33.78 15.65,30.2 v1(23.88,30.2) 28.68,30.2 v1(30.48,32) ; v1(45.09,2.54) 19.13,2.54 12.78,8.89 8.78,8.89 8.02,9.65 8.02,23.11 ; 54.1,53.72 54.1,34.54 v1(47.37,27.81) ; 8.02,23.11 v1(9.14,23.11) ; 8.02,23.11 7.62,23.11 1.02,16.51 v1(1.02,12.57)
BEEP: length 28.7
  Top Layer w0.254: 25.6,38.47 25.6,38.37 24.93,37.69 24.93,37.18 25.27,36.83 26.29,36.83 v1(27.11,36) ; Q1.1 7.07,35.94 7.11,35.94
  Bottom Layer w0.254: v1(27.11,36) 27,35.89 27,35.76 22.61,31.37 16.13,31.37 11.56,35.94 v1(7.33,35.94)
BL: length 27.3
  Top Layer w0.254: Q4.1 38.24,18.78 39.88,20.41 39.88,25.15 34.04,30.99 34.04,39.23 U4.26
CHIP_EN: length 5.9
  Top Layer w0.203: v1(50.89,41.2) 50.83,41.15 50.78,41.15 IU1.7
  Top Layer w0.254: v1(47.37,42.67) 46.99,43.05 IR3.2
  Bottom Layer w0.254: v1(47.37,42.67) 48.84,41.2 v1(50.89,41.2)
DENG: length 19.5
  Top Layer w0.254: U4.20 29.95,39.18 30.62,38.5 30.72,38.5 31.62,37.6 31.62,31.75 30.99,31.11 29.84,31.11 25.19,26.46 22.6,26.46
GPIO0: length 4.2
  Top Layer w0.254: IU1.15 46.35,39.38 v1(46.35,39.88)
  Bottom Layer w0.254: 44.7,42.29 44.7,41.53 v1(46.35,39.88)
GPIO9: length 4.9
  Top Layer w0.203: IU2.7 43.61,34.1 44.13,34.1 45.72,35.69 45.72,36.36 46.06,36.71 46.34,36.71 IU1.18
GPIO10: length 12.4
  Top Layer w0.203: IU2.3 v1(38.61,32.77) ; IU1.19 46.4,36.06 v1(46.31,36.06) 46.35,36.02
  Bottom Layer w0.203: v1(46.31,36.06) 43.02,32.77 v1(38.61,32.77)
GPIO15: length 1.9
  Top Layer w0.254: IR7.2 46.13,41.02 IU1.13
K1: length 53.8
  Top Layer w0.254: 33.82,13.93 33.82,15.7 v1(32.89,16.64) ; 33.82,13.93 36.59,13.93 36.59,7.93 ; 33.82,13.93 34.04,13.72 R40.1 ; v1(21.21,49.15) 21.81,49.75 22.81,49.75 U4.56
  Bottom Layer w0.254: v1(32.89,16.64) 32.89,35.18 27.69,40.39 27.69,41.02 21.21,47.5 v1(21.21,49.15)
K2: length 49.9
  Top Layer w0.254: v1(24.51,16.13) 23.59,15.21 23.59,13.93 ; 23.59,13.93 22.95,13.93 R37.1 ; 23.59,13.93 23.59,7.93 ; v1(22.67,50.42) 22.85,50.42 23.84,49.43
  Inner2 w0.254: v1(24.51,16.13) 25.78,17.4 25.78,48.39 23.88,50.29 22.73,50.29
K3: length 62.8
  Top Layer w0.254: v1(11.68,14.6) 11,13.92 10.6,13.92 10.6,7.92 ; R36.1 16.15,13.68 v1(15.91,13.68) ; 24.54,50.14 23.78,50.9 23.01,50.9 22.35,51.56 18.8,51.56 12.45,45.21 12.45,37.85 13.21,37.08 v1(13.21,23.24)
  Bottom Layer w0.254: v1(15.91,13.68) 14.99,14.6 v1(11.68,14.6) 9.78,16.51 9.78,19.81 v1(13.21,23.24)
K4: length 58.5
  Top Layer w0.254: U4.44 30.2,50.2 31.38,51.38 31.45,51.38 31.5,51.43 32.77,51.43 v1(33.02,51.18) ; 49.59,13.92 48.86,13.92 47.37,12.44 47.37,12.31 R39.1 ; 49.59,13.92 49.59,7.92 ; 49.59,13.92 49.59,15.44 v1(49.53,15.49)
  Bottom Layer w0.254: v1(49.53,15.49) 45.21,19.81 45.21,27.43 46.9,29.12 46.86,29.16 46.86,35.34 47.24,35.72 47.24,36.38 33.45,50.18 33.45,50.49 33.4,50.55 33.4,50.8 v1(33.02,51.18)
MOT: length 41.5
  Top Layer w0.254: v1(26.42,37.59) 26.42,37.66 U4.16 ; Q3.1 40.15,53.83 39.5,54.48 25.02,54.48 22.73,52.2 v1(18.48,52.2)
  Bottom Layer w0.254: v1(26.42,37.59) 26.42,41.53 18.48,49.47 v1(18.48,52.2)
PA5: length 23.9
  Top Layer w0.254: v1(35.08,22.32) 35,22.24 FPC1.3 ; U4.21 29.44,40.29 v1(28.73,40.29)
  Inner2 w0.254: v1(28.73,40.29) 28.57,40.13 28.57,28.83 v1(35.08,22.32)
PA6: length 20
  Top Layer w0.254: FPC1.7 33,22.24 32.26,22.99 32.26,38.18 U4.22
PA7: length 20.4
  Top Layer w0.254: 30.91,40.24 33.15,38 33.15,23.11 33.5,22.76 FPC1.6
PA8: length 25.5
  Top Layer w0.254: U4.41 31.26,49.1 32.04,49.88 32.52,49.88 v1(32.55,49.84) ; R7.1 13.84,49.28
  Bottom Layer w0.254: v1(32.55,49.84) 32.55,50.7 29.15,54.1 25.36,54.1 25.31,54.15 18.64,54.15 v1(13.84,49.35)
PA9: length 7.1
  Top Layer w0.254: v1(34.04,50.42) 33.91,50.29 32.93,50.29 32.79,50.43 32.08,50.43 31.87,50.22 31.79,50.22 31.01,49.43 30.91,49.43
  Bottom Layer w0.254: v1(34.04,50.42) 33.96,50.49 33.96,52.76 34.73,53.53
PA10: length 4.7
  Top Layer w0.254: U4.43 31.44,50.67 31.5,50.67
  Inner2 w0.254: v1(32.77,52.07) 32.77,51.94 v1(31.62,50.8)
  Bottom Layer w0.254: v1(32.77,52.07) 32.77,53.09 32.32,53.53
PA15: length 40.1
  Top Layer w0.254: v1(23.37,51.49) 23.95,52.07 24.73,52.07 U4.50 ; v1(16.26,24.64) 16.26,20.45 15.62,19.81 15.62,18.66 FPC2.2
  Inner2 w0.254: v1(16.26,24.64) 18.41,26.8 18.41,48.64 21.26,51.49 v1(23.37,51.49)
PB5: length 36.1
  Top Layer w0.254: FPC2.3 15.11,18.66 15.11,20.32 15.49,20.7 v1(15.49,22.73) ; v1(24.27,47.76) 24.09,47.76 23.13,48.72
  Inner2 w0.254: v1(15.49,22.73) 18.29,22.73 20.32,24.77 20.32,43.81 v1(24.27,47.76)
PB6: length 40.4
  Top Layer w0.254: R41.1 14.11,17.4 FPC2.5 14.11,19.55 v1(13.84,19.81) ; U4.58 24.13,47.01 24.13,46.99
  Inner2 w0.254: v1(24.23,46.89) 24.46,46.66 24.46,23.95 20.32,19.81 v1(13.84,19.81)
PB7: length 38.1
  Top Layer w0.254: R42.1 14.61,17.51 FPC2.4 v1(14.61,20.83) ; U4.59 23.37,47.07 23.37,46.48 v1(23.88,45.97)
  Inner2 w0.254: v1(14.61,20.83) 18.8,20.83 22.48,24.51 22.48,44.58 v1(23.88,45.97)
PB10: length 10.3
  Top Layer w0.254: v1(39.82,38.99) 40.65,38.99 R33.1 ; v1(34.67,40.26) 34.04,40.89 34.04,41.35 U4.29
  Bottom Layer w0.254: v1(34.67,40.26) 36.45,38.48 38.45,38.48 U9.3 39.5,38.99 v1(39.82,38.99)
PB11: length 7.3
  Top Layer w0.254: 37.85,38.1 37.97,38.23 v1(37.97,39.24) ; U4.30 34.84,41.26 v1(34.84,41.15)
  Bottom Layer w0.254: v1(37.97,39.24) 37.96,39.26 U9.4 36.73,39.26 v1(34.84,41.15)
PC8: length 29.5
  Top Layer w0.254: v1(30.61,47.12) 30.72,47.12 U4.39 ; FPC1.5 v1(34,28.63)
  Inner2 w0.254: v1(34,28.63) 34,41.95 30.61,45.34 v1(30.61,47.12)
PC9: length 31.7
  Top Layer w0.254: U4.40 30.77,47.88 30.1,47.88 v1(29.46,47.24) ; FPC1.4 34.5,23.2 34.71,23.41 v1(34.71,24.38)
  Inner2 w0.254: v1(29.46,47.24) 29.46,41.53 31.88,39.12 31.88,26.54 34.04,24.38 v1(34.71,24.38)
PD2: length 33.7
  Top Layer w0.254: FPC1.2 35.57,21.01 35.57,21.68 35.69,21.79 v1(35.69,23.88) ; v1(25.02,48.26) 25.02,48.95 U4.54
  Bottom Layer w0.254: v1(35.69,23.88) 35.69,34.36 25.02,45.03 v1(25.02,48.26)
POWER_IN: length 21.5
  Top Layer w0.254: R5.1 57.92,22.22 R25.2
  Top Layer w0.508: R25.2 C76.1 55.01,20.1 U17.6 ; USBC1.A9 59.18,10.67 59.36,10.85 59.36,13.4 59.05,13.71
  Top Layer w0.762: USBC1.B9 59.05,13.71 60.07,14.73 60.07,18.9 57.92,21.05 R5.1
REF: length 6.6
  Top Layer w0.254: U4.13 24.87,39.18 24.22,38.53 24.22,37.18 25.16,36.25 ; 25.29,36.31 25.21,36.23 U22.2
RST: length 23.9
  Top Layer w0.254: v1(21.85,40.13) 21.85,40.37 U4.7 22.88,41.3 23.55,41.97 24.45,41.97 26.42,40 27.58,40 32.28,44.7 34.93,44.7 36.13,45.91 C87.2 36.08,49.46 R1.1
RXD: length 17.9
  Top Layer w0.254: v1(41.15,48.26) 41.92,48.26 R50.1 ; U4.51 26.13,49.97 v1(26.61,49.97)
  Inner2 w0.254: v1(41.15,48.26) 40.48,48.93 31.59,48.93 30.55,49.97 27.68,49.97 27.67,49.96 27.19,49.96 27.18,49.97 v1(26.61,49.97)
SD_CLK: length 2.1
  Top Layer w0.203: IR8.2 46.67,34.66 46.67,35.12 47.24,35.69 47.37,35.69 47.76,36.07 IU1.21
SD_CMD: length 13.1
  Top Layer w0.203: IU2.1 36.59,35.43 37.85,35.43 39.12,34.16 41.83,34.16 42.52,33.48 44.58,33.48 44.9,33.8 44.9,33.86 IU1.20
SD_D0: length 12.4
  Top Layer w0.203: IU1.22 47.58,35.11 v1(47.46,35.11) ; IU2.2 v1(38.1,34.04)
  Inner2 w0.254: v1(38.1,34.04) 46.38,34.04 v1(47.46,35.11)
SD_D1: length 6.6
  Top Layer w0.203: IU2.5 44.66,31.5 IU1.23
SWCLK: length 29.8
  Top Layer w0.254: v1(24.76,52.83) 24.76,52.74 U4.49
  Inner2 w0.254: 3.17,37.59 3.17,37.86 18.15,52.83 v1(24.76,52.83)
SWDIO: length 35.1
  Top Layer w0.254: U4.46 28.81,50.16 27.69,50.16 27.43,50.42 v1(27.43,50.55)
  Inner2 w0.254: H1.2 11.94,43.81 11.94,44.83 19.18,52.07 25.91,52.07 v1(27.43,50.55)
TXD: length 17.2
  Top Layer w0.254: U4.52 25.77,49.61 25.77,49.47 25.78,49.47 v1(25.78,49.28) ; R49.1 v1(39.37,46.86)
  Inner2 w0.254: v1(25.78,49.28) 26.54,48.51 31.62,48.51 32.77,47.37 38.86,47.37 v1(39.37,46.86)
TXIN: length 7.7
  Top Layer w0.254: U4.3 20.43,41.78 18.67,41.78 17.12,43.33 17.01,43.33 16.62,42.94 14.81,42.94
TXOUT: length 7.8
  Top Layer w0.254: U4.4 20.14,40.78 X2.2 17.01,40.91 16.71,41.21 14.99,41.21 14.86,41.09
XIN: length 9.5
  Top Layer w0.254: 16.61,36.25 18.04,36.25 X1.1 18.59,35.99 19.3,36.7 19.3,39.24 U4.5
XOUT: length 6.6
  Top Layer w0.254: U4.6 20.5,39.73 X1.3 21.71,37.74 22.17,37.28
$1N2367: length 2.1
  Top Layer w0.254: D5.2 3.17,32.51
$1N3753: length 3.4
  Top Layer w0.254: R10.2 57.15,14.34 57.15,13.08 57.54,12.69 USBC1.B5
$1N3756: length 2
  Top Layer w0.254: R11.2 USBC1.A5
$1N3989: length 9.5
  Top Layer w0.254: U17.7 53.75,21.37 v1(54.23,21.84) ; v1(61.21,20.83) 61.38,20.66 U6.1
  Bottom Layer w0.254: v1(61.21,20.83) 60.2,21.84 v1(54.23,21.84)
$1N3995: length 2.7
  Top Layer w0.254: U6.2 62.06,22.22 R5.2
$1N8286: length 1.8
  Top Layer w0.508: U17.8 53.3,23.78 R24.2
$1N8329: length 8
  Top Layer w0.254: v1(49.4,22.73) 49.31,22.64 U17.1 ; R25.1 55.31,23.75 v1(54.48,23.75)
  Bottom Layer w0.254: v1(54.48,23.75) 50.42,23.75 v1(49.4,22.73)
$1N9596: length 3.2
  Top Layer w0.254: R27.1 R28.2 7.87,26.58 8.6,25.84
$1N9921: length 3.2
  Top Layer w0.254: U20.5 4.2,9.49 R30.2 R29.1
$1N10265: length 15
  Top Layer w0.508: v1(10.92,41.15) 11.3,41.53 11.91,41.53 8,45.44 BUZ1.2 ; v1(8.25,38.48) 7.51,38.48 Q1.3
  Inner2 w0.508: v1(10.92,41.15) v1(8.25,38.48)
$1N10725: length 23.8
  Top Layer w0.762: 23.28,22.88 23.28,22.06 v1(23.69,21.65) ; v1(18.16,4.95) 19.05,4.95
  Bottom Layer w0.762: v1(23.69,21.65) 23.69,16.49 20.19,13 20.19,12.06 19.3,11.18 17.46,11.18 16.38,10.1 16.38,6.73 v1(18.16,4.95)
$1N10946: length 4.3
  Top Layer w0.762: Q2.3 21.65,20.3 21.78,20.17
$1N13943: length 9.6
  Top Layer w0.254: FPC1.11 31,19.18 R31.1 30.52,18.87 ; 30.52,18.87 30.02,18.87 29.5,19.39 FPC1.14 ; 30.52,18.87 30.5,18.89 ; 30.5,18.89 29.99,19.41 29.99,20.92 FPC1.13 ; 30.5,18.89 FPC1.12
$1N14140: length 6
  Top Layer w0.254: Q4.3 35.95,17.28 R31.2
$1N14527: length 8.1
  Top Layer w0.254: 42.16,43.69 R34.1 42.16,39.5 R33.2 41.14,37.97 R32.2
$1N17677: length 9.9
  Top Layer w0.508: R26.1 43.43,22.44 ; 43.43,22.44 43.43,19.81 L3.1 ; 43.43,22.44 45.78,20.1 U17.3
$1N17682: length 2.3
  Top Layer w0.254: U17.4 47.38,18.83 47.35,18.8 45.98,18.8 L3.2
$1N18024: length 5.3
  Top Layer w0.254: R43.1 R44.1 17.16,15.5 R42.2 R41.2
$1N27707: length 8.7
  Top Layer w0.254: IU1.27 51.82,34.63 51.82,31.01 IX1.3 50.56,30.12 IC8.1
$1N27710: length 7.3
  Top Layer w0.254: IU1.28 52.94,34.21 IX1.1 53.09,31.49 IC7.1
$1N27714: length 2.4
  Top Layer w0.254: IU1.31 52.57,36.7 53.6,36.7 IR1.2
$1N27716: length 4.8
  Top Layer w0.203: IU1.2 52.79,39.62 L1.2
  Top Layer w0.254: IC6.2 54.99,39.69 L1.2
$1N27723: length 2.1
  Top Layer w0.254: R45.1 50.79,34.95 IU1.26
$1N27768: length 2.5
  Top Layer w0.203: IU2.6 44.96,32.77 IR8.1
$1N27773: length 1.5
  Top Layer w0.254: IR3.1 R2.2
$1N33567: length 12.6
  Top Layer w0.254: R7.2 v1(10.67,49.28) ; LED1.2 v1(1.02,47.37)
  Bottom Layer w0.254: v1(10.67,49.28) 2.92,49.28 v1(1.02,47.37)
$1N34275: length 7.3
  Top Layer w0.508: C90.2 C89.2 Q3.3 42.16,52.82 v1(42.16,51.94)
  Bottom Layer w0.508: v1(42.16,51.94) 41.28,51.94 NOREF#5.1
$1N37143: length 24.6
  Top Layer w0.254: v1(42.67,46.86) R49.2 ; R45.2 v1(48.39,33.4)
  Bottom Layer w0.254: v1(48.39,33.4) 49.66,33.4 51.05,34.8 51.05,36.19 51.69,36.83 51.69,38.35 50.16,39.88 47.75,39.88 45.72,41.91 45.72,45.85 ; NOREF#6.2 46.35,46.48 45.72,45.85 ; 45.72,45.85 44.7,46.86 v1(42.67,46.86)
$1N37193: length 18.7
  Top Layer w0.254: R50.2 43.69,48 v1(43.69,45.72) ; IU1.25 50.02,34.91 v1(49.66,34.54)
  Bottom Layer w0.254: 43.69,44.26 43.69,41.4 49.66,35.43 v1(49.66,34.54) ; 43.69,44.26 v1(43.69,45.72) ; 43.69,44.26 42.99,44.96 42.04,44.96

## Copper pours and planes (outline as drawn; the poured copper is in the pictures)
3V3 on Top Layer: 2.92,24.13 4.57,24.13 4.57,19.43 2.92,19.43
GND on Top Layer: -2.41,57.91 66.29,57.91 66.29,-3.3 -2.41,-3.3
GND on Top Layer: 63.63,24.64 34.16,24.64 34.16,48.01 63.63,48.01
GND on Top Layer: 14.1,16.51 0.76,16.51 0.76,30.48 14.1,30.48
GND on Top Layer: -2.03,19.56 11.3,19.56 11.3,5.59 -2.03,5.59
GND on Bottom Layer: -6.98,59.69 70.61,59.69 70.61,-6.35 -6.98,-6.35
GND on Inner1: -7.62,59.82 72.9,59.82 72.9,-1.78 -7.62,-1.78
GND on Inner2: -10.16,70.61 82.17,70.61 82.17,-15.49 -10.16,-15.49
1.8 on Top Layer: 7.49,16.64 9.14,16.64 9.14,11.94 7.49,11.94
BAT+ on Top Layer: 18.41,3.05 44.32,3.05 44.32,0.76 18.41,0.76
$1N8901 on Top Layer: 5.21,24.38 8,24.38 8,19.3 5.21,19.3
$1N9902 on Top Layer: 4.06,16.76 6.86,16.76 6.86,11.68 4.06,11.68
$1N10725 on Top Layer: 18.67,5.97 44.32,5.97 44.32,3.56 18.67,3.56
$1N27754 on Top Layer: 52.7,41.3 53.33,40.67 51.56,38.9 50.93,39.53

Small or netless copper shapes (teardrops, artwork), in the pictures only: 2 on Top Layer

## Text on the board
Bottom Silkscreen Layer: DIO | CLK | GND | B+ | M
